# EAGLE design massmfg_tinyx4_v1_2 (EAGLE 6.4)
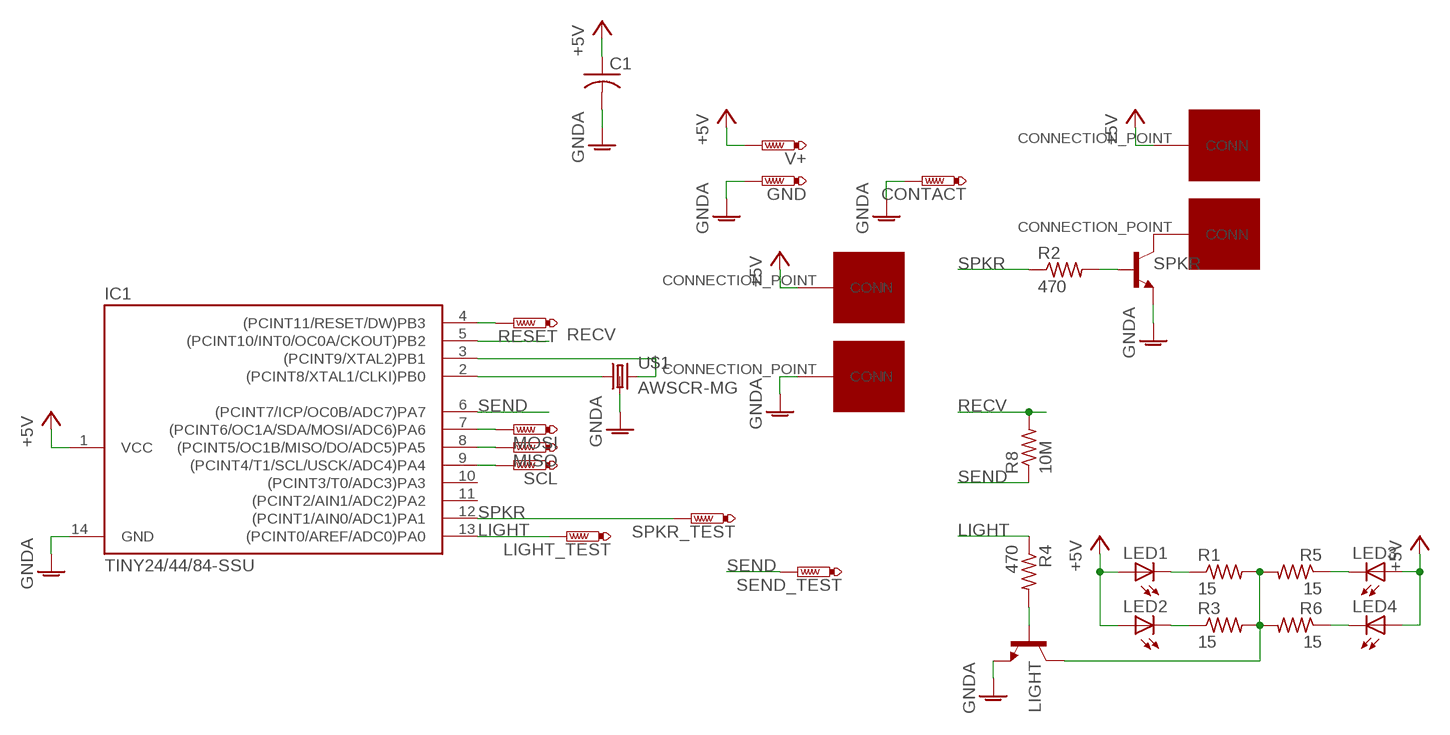
[diagram p0: schematic, sheet 1]

## Parts
C1  C-USC0603  [C0603]
CONTACT  PTR1  [P1-06]
GND  PTR1  [P1-06]
IC1  TINY24/44/84-SSU  [SOIC14]
LED1  LEDOPTEK-DURIS5  [OPTEK-DURIS5]
LED2  LEDOPTEK-DURIS5  [OPTEK-DURIS5]
LED3  LEDOPTEK-DURIS5  [OPTEK-DURIS5]
LED4  LEDOPTEK-DURIS5  [OPTEK-DURIS5]
LIGHT  SOT23-BEC  [SOT23-BEC]
LIGHT_TEST  PTR1  [P1-06]
MISO  PTR1  [P1-06]
MOSI  PTR1  [P1-06]
R1  15  R-US_M1206  [M1206]
R2  470  R-US_R0805  [R0805]
R3  15  R-US_M1206  [M1206]
R4  470  R-US_R0805  [R0805]
R5  15  R-US_M1206  [M1206]
R6  15  R-US_M1206  [M1206]
R8  10M  R-US_M1206  [M1206]
RESET  PTR1  [P1-06]
SCL  PTR1  [P1-06]
SEND_TEST  PTR1  [P1-06]
SPEAKER_PLUS  CONNECTION_POINT  [10X3_CONNECTION_POINT]
SPKR  SOT23-BEC  [SOT23-BEC]
SPKR_MINUS  CONNECTION_POINT  [10X3_CONNECTION_POINT]
SPKR_TEST  PTR1  [P1-06]
U$1  AWSCR-MG  [AWSCR-MG]
U$3  CONNECTION_POINT  [10X3_CONNECTION_POINT]
U$5  CONNECTION_POINT  [10X3_CONNECTION_POINT]
V+  PTR1  [P1-06]

## Nets
+5V: C1.1 IC1.1(VCC) LED1.ANODE(A) LED2.ANODE(A) LED3.ANODE(A) LED4.ANODE(A) SPEAKER_PLUS.CONNECTION_POINT(CONN) U$3.CONNECTION_POINT(CONN) V+.TP
GNDA: C1.2 CONTACT.TP GND.TP IC1.14(GND) LIGHT.E SPKR.E U$1.GND U$5.CONNECTION_POINT(CONN)
LIGHT: IC1.13((PCINT0/AREF/ADC0)PA0) LIGHT_TEST.TP R4.1
N$1: LIGHT.B R4.2
N$2: IC1.2((PCINT8/XTAL1/CLKI)PB0) U$1.IN
N$3: LED2.CATHODE(C) R3.1
N$4: IC1.3((PCINT9/XTAL2)PB1) U$1.OUT
N$5: LED1.CATHODE(C) R1.1
N$6: R2.2 SPKR.B
N$7: LED3.CATHODE(C) R5.1
N$8: LED4.CATHODE(C) R6.1
N$9: SPKR.C SPKR_MINUS.CONNECTION_POINT(CONN)
N$12: IC1.4((PCINT11/RESET/DW)PB3) RESET.TP
N$13: IC1.7((PCINT6/OC1A/SDA/MOSI/ADC6)PA6) MOSI.TP
N$14: IC1.8((PCINT5/OC1B/MISO/DO/ADC5)PA5) MISO.TP
N$15: IC1.9((PCINT4/T1/SCL/USCK/ADC4)PA4) SCL.TP
N$18: LIGHT.C R1.2 R3.2 R5.2 R6.2
RECV: IC1.5((PCINT10/INT0/OC0A/CKOUT)PB2) R8.2
SEND: IC1.6((PCINT7/ICP/OC0B/ADC7)PA7) R8.1 SEND_TEST.TP
SPKR: IC1.12((PCINT1/AIN0/ADC1)PA1) R2.1 SPKR_TEST.TP
Unconnected: IC1.10((PCINT3/T0/ADC3)PA3) IC1.11((PCINT2/AIN1/ADC2)PA2)

## Library data of the parts
C1 = rcl:C-US: CAPACITOR, American symbol
CONTACT GND LIGHT_TEST MISO MOSI RESET SCL SEND_TEST SPKR_TEST V+ = testpad:PTR1: TEST PIN
IC1 = avr-5:TINY24/44/84
LED1-LED4 = smd_parts:LED: LED OSRAM: - CHIPLED LG R971, LG N971, LY N971, LG Q971, LY Q971, LO R971, LY R971 LH N974, LH R974 LS Q976, LO Q976, LY Q976 LO Q996 - Hyper CHIPLED LW Q18S LB Q993, LB Q99A, LB R99A - SideLED LS A670, LO A670, LY A670, LG A670, LP A670 LB A673, LV A673, LT A673, LW A673 LH A674 LY A675 LS A676, LA A676, LO A676, LY A676, LW A676 LS A679, LY A679, LG A679 - Hyper Micro SIDELED® LS Y876, LA Y876, LO Y876, LY Y876 LT Y87S - SmartLED LW L88C, LW L88S LB L89C, LB L89S, LG L890 LS L89K, LO L89K, LY L89K LS L896, LA L896, LO L896, LY L896 - TOPLED LS T670, LO T670, LY T670, LG T670, LP T670 LSG T670, LSP T670, LSY T670, LOP T670, LYG T670 LG T671, LOG T671, LSG T671 LB T673, LV T673, LT T673, LW T673 LH T674 LS T676, LA T676, LO T676, LY T676, LB T676, LH T676, LSB T676, LW T676 LB T67C, LV T67C, LT T67C, LS T67K, LO T67K, LY T67K, LW E67C LS E67B, LA E67B, LO E67B, LY E67B, LB E67C, LV E67C, LT E67C LW T67C LS T679, LY T679, LG T679 LS T770, LO T770, LY T770, LG T770, LP T770 LB T773, LV T773, LT T773, LW T773 LH T774 LS E675, LA E675, LY E675, LS T675 LS T776, LA T776, LO T776, LY T776, LB T776 LHGB T686 LT T68C, LB T68C - Hyper Mini TOPLED® LB M676 - Mini TOPLED Santana® LG M470 LS M47K, LO M47K, LY M47K Source: http://www.osram.convergy.de LUXEON: - LUMILED® LXK2-PW12-R00, LXK2-PW12-S00, LXK2-PW14-U00, LXK2-PW14-V00 LXK2-PM12-R00, LXK2-PM12-S00, LXK2-PM14-U00 LXK2-PE12-Q00, LXK2-PE12-R00, LXK2-PE12-S00, LXK2-PE14-T00, LXK2-PE14-U00 LXK2-PB12-K00, LXK2-PB12-L00, LXK2-PB12-M00, LXK2-PB14-N00, LXK2-PB14-P00, LXK2-PB14-Q00 LXK2-PR12-L00, LXK2-PR12-M00, LXK2-PR14-Q00, LXK2-PR14-R00 LXK2-PD12-Q00, LXK2-PD12-R00, LXK2-PD12-S00 LXK2-PH12-R00, LXK2-PH12-S00 LXK2-PL12-P00, LXK2-PL12-Q00, LXK2-PL12-R00 Source: www.luxeon.com KINGBRIGHT: KA-3528ASYC Source: www.kingbright.com
LIGHT SPKR = smd_parts:SOT23-BEC
R1-R6 R8 = resistor:R-US_: RESISTOR, American symbol
SPEAKER_PLUS SPKR_MINUS U$3 U$5 = smd_parts:CONNECTION_POINT
U$1 = smd_parts:AWSCR-MG

## Board
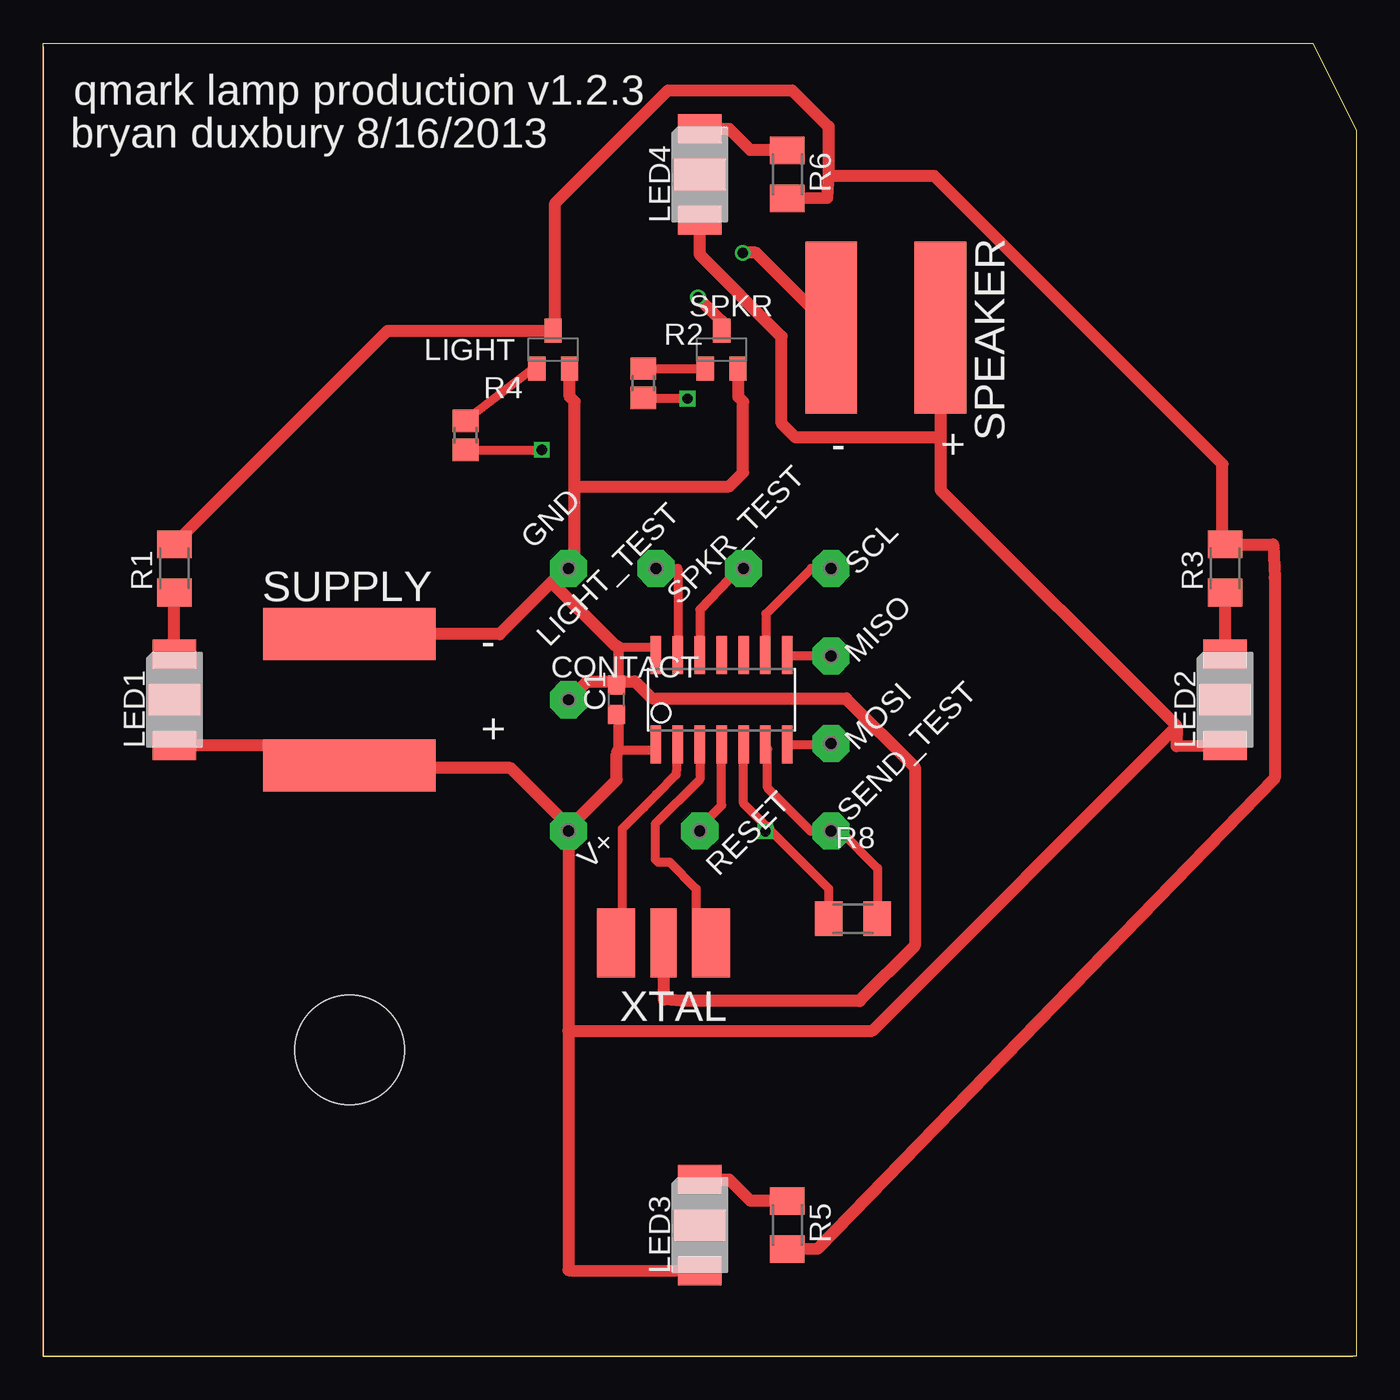
[diagram p1: board, top side]
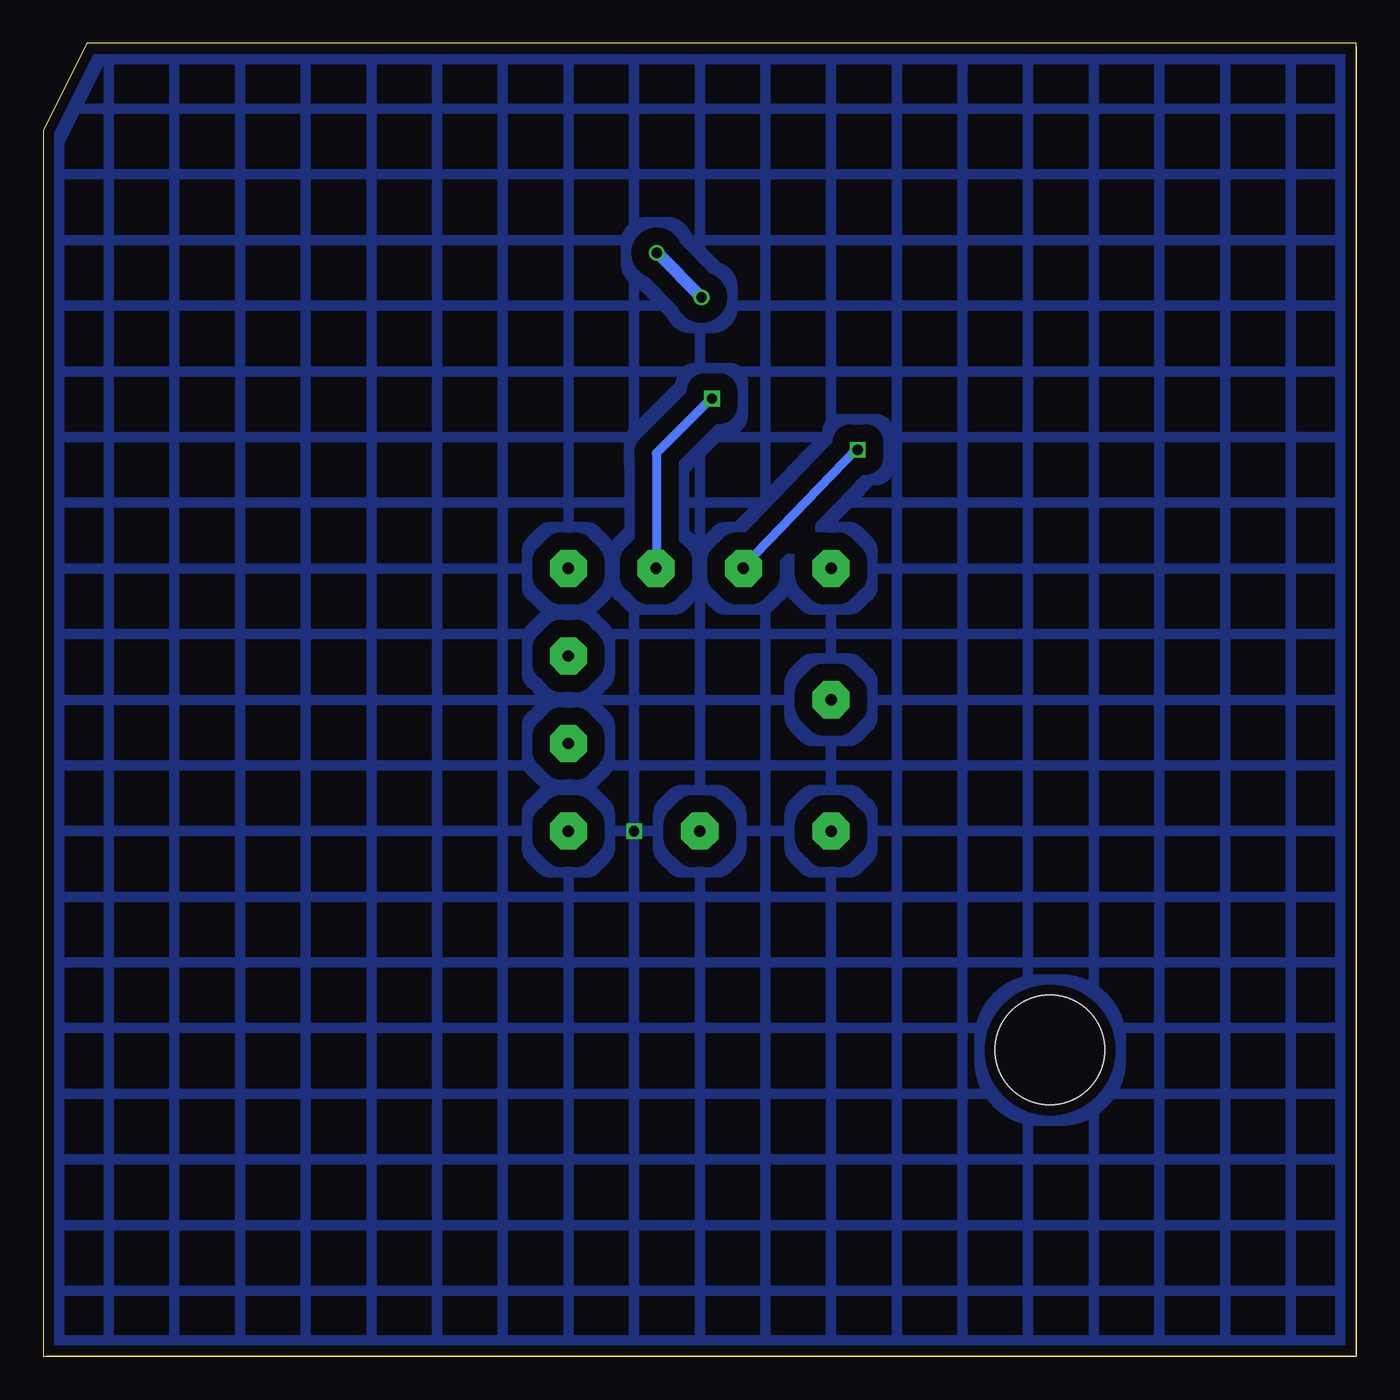
[diagram p2: board, bottom side, seen from below]

Size 76.2 x 76.2 mm. Coordinates in mm from the lower left corner, seen from the top.
Outline: 0,0 76,0
Outline: 0,76 0,0
Outline: 0,0 76.2,0 76.2,71.12 73.66,76.2 0,76.2 0,0
Copper layers (1*16): Top 0.035mm / dielectric 1.5mm / Bottom 0.035mm
Design rules "Fusion_eagle_rule_v1.1 *": minimum track width 0.7mm, minimum drill 0.599440625mm, track to track 40mil, track to pad 40mil, pad to pad 40mil, via to via 40mil, smd to smd 0mil, copper to edge 10mil, drill to drill 10mil, minimum pad ring 10mil, minimum via ring 6mil, stop-mask expansion 2mil, vias tented up to drill 100mil, thermal gap 10mil
Holes 6.35 mm at 17.78,17.78

### Footprints (pad centres in the part's own frame; a part is rotated, then mirrored left to right if it is on the bottom)
C0603 = smd 1.1 x 1: 1 -0.85,0; 2 0.85,0
P1-06 = drill 0.66 pad 2.159 octagon: TP 0,0
SOIC14 = smd 0.61 x 2.21: 1 -3.81,-2.603; 2 -2.54,-2.603; 3 -1.27,-2.603; 4 0,-2.603; 5 1.27,-2.603; 6 2.54,-2.603; 7 3.81,-2.603; 8 3.81,2.603; 9 2.54,2.603; 10 1.27,2.603; 11 0,2.603; 12 -1.27,2.603; 13 -2.54,2.603; 14 -3.81,2.603
OPTEK-DURIS5 = smd 2.5 x 1.7: ANODE 0,-2.65; CATHODE 0,2.65 | smd 3 x 1.8: P$5 0,0
SOT23-BEC = smd 1 x 1.4: B -0.95,-1.1; C 0,1.1; E 0.95,-1.1
M1206 = smd 1.6 x 2: 1 -1.4,0; 2 1.4,0
R0805 = smd 1.3 x 1.5: 1 -0.85,0; 2 0.85,0
10X3_CONNECTION_POINT = smd 3 x 10: CONNECTION_POINT 0,0
AWSCR-MG = smd 1.5 x 4: GND 0,0 | smd 2.2 x 4: IN -2.75,0; OUT 2.75,0

### Placement (x,y rotation side)
C1  33.27,38.1 90 top
CONTACT  30.48,38.1 0 top
GND  30.48,45.72 0 top
IC1  39.37,38.1 0 top
LED1  7.62,38.1 0 top
LED2  68.58,38.1 0 top
LED3  38.1,7.62 0 top
LED4  38.1,68.58 0 top
LIGHT  29.59,58.42 0 top
LIGHT_TEST  35.56,45.72 0 top
MISO  45.72,40.64 0 top
MOSI  45.72,35.56 0 top
R1  7.62,45.72 90 top
R2  34.82,56.46 90 top
R3  68.58,45.72 90 top
R4  24.51,53.44 90 top
R5  43.18,7.62 270 top
R6  43.18,68.58 270 top
R8  46.99,25.4 180 top
RESET  38.1,30.48 0 top
SCL  45.72,45.72 0 top
SEND_TEST  45.72,30.48 0 top
SPEAKER_PLUS  52.07,59.69 0 top
SPKR  39.37,58.42 0 top
SPKR_MINUS  45.72,59.69 0 top
SPKR_TEST  40.64,45.72 0 top
U$1  36,24 0 top
U$3  17.78,34.29 90 top
U$5  17.78,41.91 90 top
V+  30.48,30.48 0 top

### Tracks (layer width: path | path; a pad name or v marks a point on that pad's centre or on a via)
+5V
  Top 0.508: C1.1 33.4,37.25 | 33.4,35.18 35.56,35.18 IC1.1
  Top 0.61: 33.4,37.25 33.4,35.18
  Top 0.7: 65.77,36.56 52.07,50.27 52.07,53.31 | 65.77,36.56 65.76,35.41 LED2.ANODE | SPEAKER_PLUS.CONNECTION_POINT 52.07,53.31 | LED4.ANODE 38.1,63.93 42.85,59.18 42.85,54.13 43.66,53.31 52.07,53.31 | LED1.ANODE 7.62,35.43 16.64,35.43 U$3.CONNECTION_POINT 18.11,34.14 27.13,34.14 30.3,30.96 V+.TP | V+.TP 30.48,18.9 | 30.48,18.9 30.48,5 LED3.ANODE | 33.4,35.18 33.27,34.95 33.27,33.45 30.63,30.81 V+.TP | 65.77,36.56 48.11,18.9 30.48,18.9
GNDA
  Top 0.508: C1.2 33.4,38.95 | 33.4,41.15 35.56,41.15 IC1.14
  Top 0.61: 33.4,38.95 33.4,41.15
  Top 0.7: CONTACT.TP 31.55,39.17 33.15,39.17 C1.2 33.63,39.17 34.34,39.17 35.33,38.18 46.58,38.18 50.57,34.19 50.57,23.82 47.37,20.62 37.08,20.62 36.02,20.7 36.02,23.98 U$1.GND | U$5.CONNECTION_POINT 26.49,41.91 29.52,44.93 | 29.52,44.93 30.15,45.57 GND.TP 30.84,45.77 30.84,50.47 | 29.52,44.93 33.17,41.27 33.4,41.15 | 30.84,50.47 30.84,55.4 30.56,55.68 30.56,57.3 LIGHT.E | 30.84,50.47 39.8,50.47 40.62,51.28 40.62,55.4 40.34,55.68 40.34,57.3 SPKR.E
LIGHT  (via drill 0.6)
  Top 0.508: IC1.13 36.83,45.72 LIGHT_TEST.TP v35.61,45.77 | R4.1 v28.92,52.59 v28.93,52.6
  Bottom 0.508: v28.93,52.6 28.98,52.68 v35.61,45.77
N$1
  Top 0.508: LIGHT.B 28.74,57.55 R4.2
N$2
  Top 0.508: IC1.2 36.73,33.76 35.59,32.61 34.87,31.88 33.6,30.61 33.6,24.35 U$1.IN
N$3
  Top 0.7: LED2.CATHODE R3.1
N$4
  Top 0.508: IC1.3 38.1,33.48 35.51,30.89 35.51,28.85 35.69,28.68 36.35,28.68 37.9,27.13 37.9,25.12 39.37,23.65 39.1,23.65 U$1.OUT
N$5
  Top 0.7: LED1.CATHODE R1.1
N$6
  Top 0.508: R2.2 SPKR.B
N$7
  Top 0.7: R5.1 43.18,9.04 41.02,9.04 39.8,10.26 LED3.CATHODE
N$8
  Top 0.7: R6.1 43.18,70 41.02,70 39.8,71.22 LED4.CATHODE
N$9  (via drill 0.6)
  Top 0.7: SPKR.C 39.37,60.07 v38,61.44 | v40.59,64.03 41.38,64.03 SPKR_MINUS.CONNECTION_POINT
  Bottom 0.7: v40.59,64.03 v38,61.44
N$12
  Top 0.508: RESET.TP 38.1,30.71 39.37,31.98 IC1.4
N$13
  Top 0.508: IC1.7 45.66,35.5 MOSI.TP
N$14
  Top 0.508: MISO.TP 43.24,40.64 IC1.8
N$15
  Top 0.508: SCL.TP 44.58,45.72 41.94,43.08 41.94,40.73 IC1.9
N$18
  Top 0.7: R5.2 44.93,6.25 71.45,33.55 71.45,45.19 71.37,47.12 R3.2 68.43,47.45 68.43,51.77 51.71,68.48 45.9,68.48 45.57,68.63 | R1.2 7.62,47.14 19.99,59.51 LIGHT.C 29.72,59.87 29.72,66.9 36.27,73.46 43.46,73.46 45.57,71.35 45.57,68.63 | 45.57,68.63 45.49,67.21 R6.2
RECV  (via drill 0.6)
  Top 0.508: R8.2 45.59,27.13 42.08,30.64 40.64,32.08 IC1.5
  Top 0.7: v41.91,30.48 42.08,30.64
  pour Bottom (isolate 0.61, hatched): 0.25,75.95 75.95,75.95 75.95,0.25 0.25,0.25
SEND
  Top 0.508: IC1.6 42.04,35.24 42.04,32.99 44.53,30.48 SEND_TEST.TP 46.25,30.48 48.41,28.32 48.41,25.42 R8.1
SPKR  (via drill 0.6)
  Top 0.508: SPKR_TEST.TP 40.39,45.72 38.1,43.33 IC1.12 | R2.1 37.35,55.61 v37.39,55.58
  Bottom 0.508: v37.39,55.58 37.44,55.58 40.62,52.4 40.62,45.74 SPKR_TEST.TP

### Text on the board
tNames: qmark lamp production v1.2.3 | bryan duxbury 8/16/2013 | SPEAKER | + | SUPPLY | + | XTAL
_tsilk: - | -